# EAGLE design IR_linebot (EAGLE 5.06)
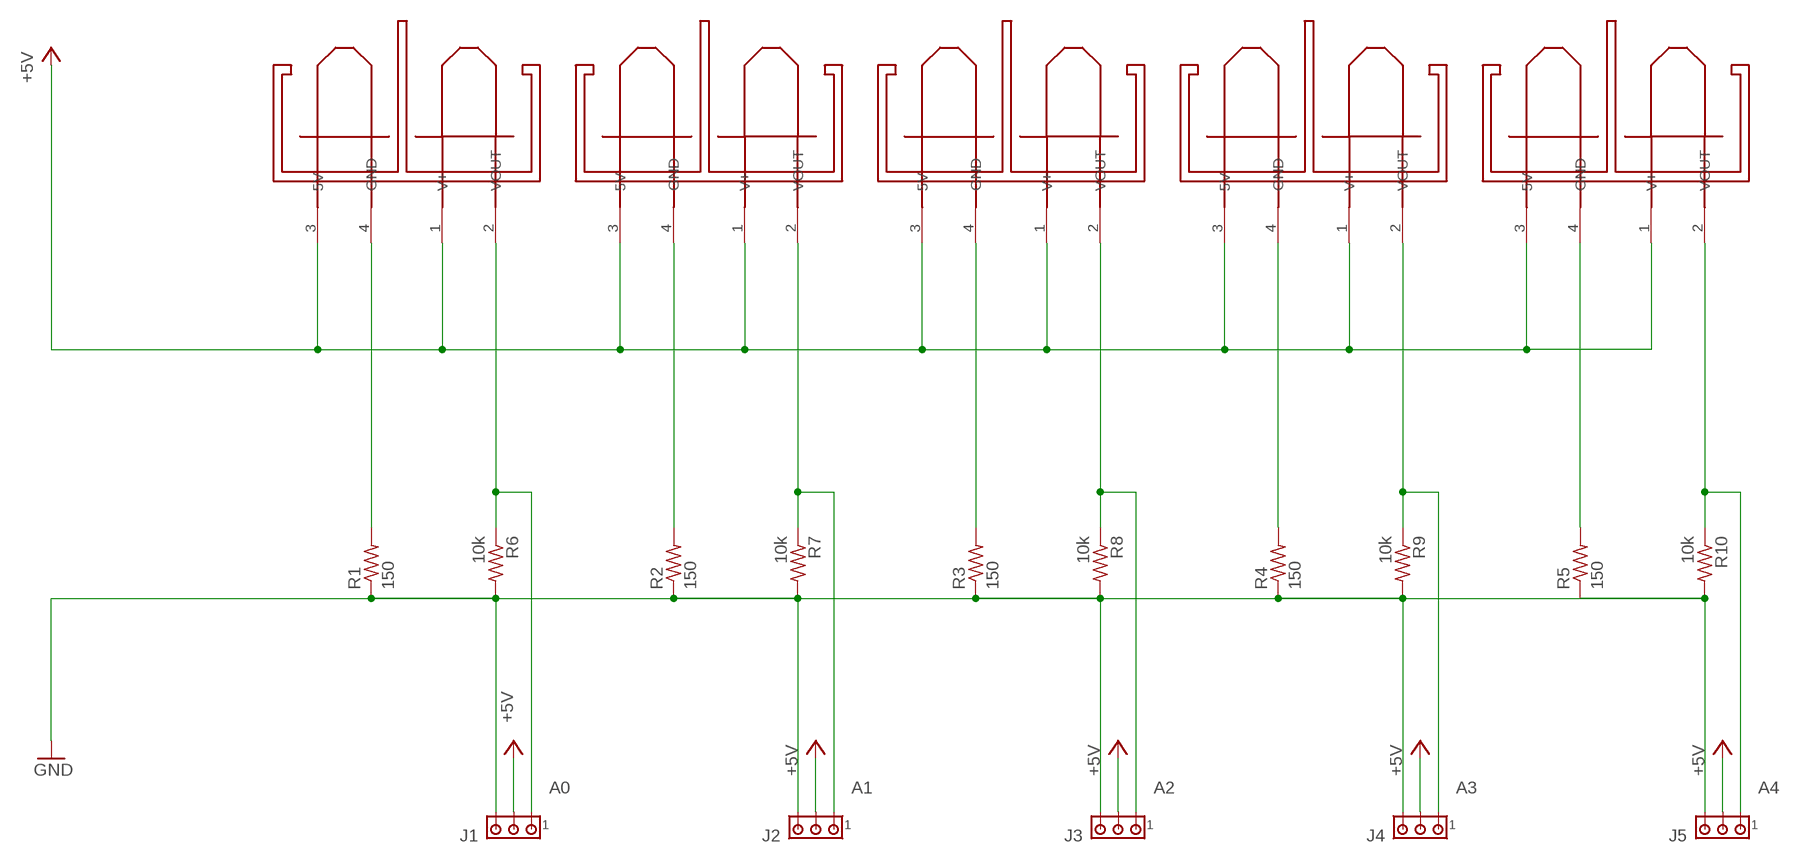
[diagram p0: schematic, sheet 1]

## Parts
IR1  IR_PAIR1  [IR_1]
IR2  IR_PAIR1  [IR_1]
IR3  IR_PAIR1  [IR_1]
IR4  IR_PAIR1  [IR_1]
IR5  IR_PAIR1  [IR_1]
J1  MTA03-100  [10X03MTA]
J2  MTA03-100  [10X03MTA]
J3  MTA03-100  [10X03MTA]
J4  MTA03-100  [10X03MTA]
J5  MTA03-100  [10X03MTA]
R1  150  R-US_0204/7  [0204/7]
R2  150  R-US_0204/7  [0204/7]
R3  150  R-US_0204/7  [0204/7]
R4  150  R-US_0204/7  [0204/7]
R5  150  R-US_0204/7  [0204/7]
R6  10k  R-US_0204/7  [0204/7]
R7  10k  R-US_0204/7  [0204/7]
R8  10k  R-US_0204/7  [0204/7]
R9  10k  R-US_0204/7  [0204/7]
R10  10k  R-US_0204/7  [0204/7]

## Nets
+5V: IR1.1(V+) IR1.3(5V) IR2.1(V+) IR2.3(5V) IR3.1(V+) IR3.3(5V) IR4.1(V+) IR4.3(5V) IR5.1(V+) IR5.3(5V) J1.2 J2.2 J3.2 J4.2 J5.2
A0: IR1.2(VOUT) J1.1 R6.1
A1: IR2.2(VOUT) J2.1 R7.1
A2: IR3.2(VOUT) J3.1 R8.1
A3: IR4.2(VOUT) J4.1 R9.1
A4: IR5.2(VOUT) J5.1 R10.1
GND: J1.3 J2.3 J3.3 J4.3 J5.3 R1.1 R2.1 R3.1 R4.1 R5.1 R6.2 R7.2 R8.2 R9.2 R10.2
N$1: IR1.4(GND) R1.2
N$2: IR2.4(GND) R2.2
N$3: IR3.4(GND) R3.2
N$4: IR4.4(GND) R4.2
N$5: IR5.4(GND) R5.2

## Library data of the parts
IR1-IR5 = A-JD3:IR_PAIR1
J1-J5 = con-amp:MTA03-100: AMP connector
R1-R10 = resistor:R-US_: RESISTOR, American symbol

## Board
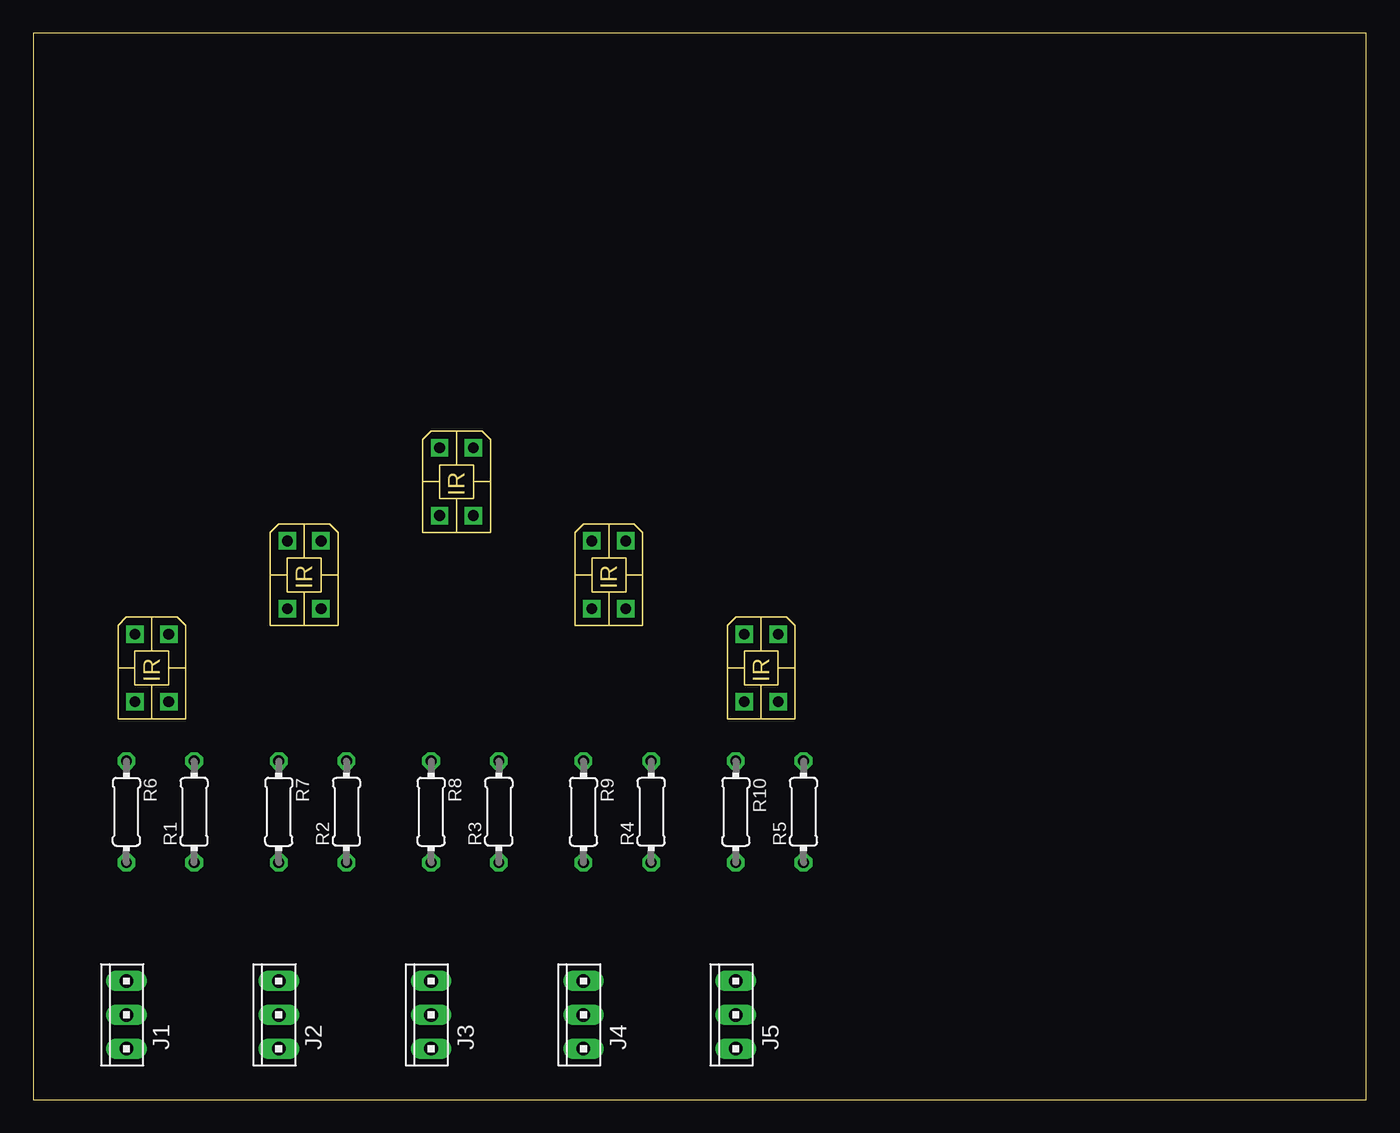
[diagram p1: board, top side]
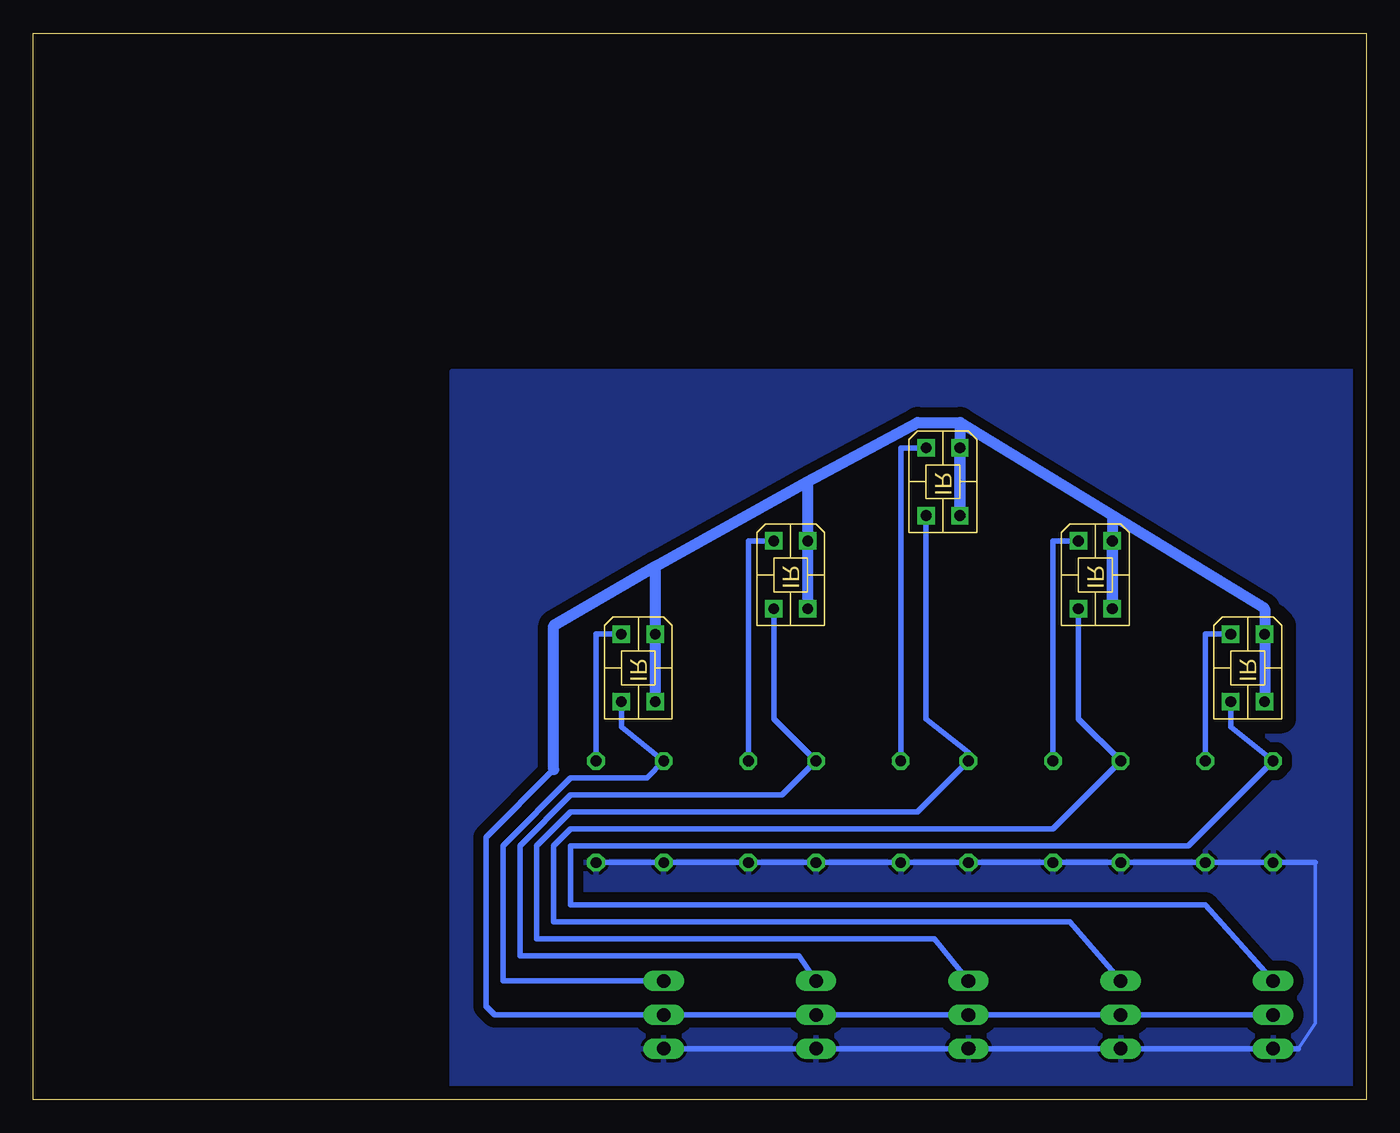
[diagram p2: board, bottom side, seen from below]

Size 100 x 80 mm. Coordinates in mm from the lower left corner, seen from the top.
Outline: 0,0 100,0 100,80 0,80 0,0
Copper layers (1*16): Top 0.035mm / dielectric 1.5mm / Bottom 0.035mm
Design rules "default *": minimum track width 10mil, minimum drill 24mil, track to track 30mil, track to pad 30mil, pad to pad 8mil, via to via 8mil, smd to smd 8mil, copper to edge 40mil, drill to drill 8mil, minimum pad ring 10mil, minimum via ring 8mil, stop-mask expansion 4mil, vias tented up to drill 0mil, thermal gap 10mil

### Footprints (pad centres in the part's own frame; a part is rotated, then mirrored left to right if it is on the bottom)
IR_1 = drill 0.8 square: 1 -2.54,1.27; 2 -2.54,-1.27; 3 2.54,1.27; 4 2.54,-1.27
10X03MTA = drill 1.016 long: 1 2.54,0; 2 0,0; 3 -2.54,0
0204/7 = drill 0.813 octagon: 1 -3.81,0; 2 3.81,0

### Placement (x,y rotation side)
IR1  8.89,32.38 90 top
IR2  20.32,39.37 90 top
IR3  31.75,46.35 90 top
IR4  43.18,39.37 90 top
IR5  54.61,32.38 90 top
J1  6.99,6.35 90 top
J2  18.41,6.35 90 top
J3  29.84,6.35 90 top
J4  41.27,6.35 90 top
J5  52.7,6.35 90 top
R1  12.06,21.59 90 top
R2  23.5,21.59 90 top
R3  34.92,21.59 90 top
R4  46.35,21.59 90 top
R5  57.78,21.59 90 top
R6  6.99,21.59 270 top
R7  18.41,21.59 270 top
R8  29.84,21.59 270 top
R9  41.27,21.59 270 top
R10  52.7,21.59 270 top

### Tracks (layer width: path | path; a pad name or v marks a point on that pad's centre or on a via)
+5V
  Bottom 0.406: J1.2 J2.2 J3.2 J4.2 J5.2 65.41,6.35 66.04,6.99 66.04,19.68 60.96,24.77
  Bottom 0.813: IR1.1 IR1.3 7.62,36.83 19.05,43.81 | 19.05,43.81 IR2.1 IR2.3 19.05,43.81 | 30.48,50.8 IR3.1 IR3.3 30.48,50.8 | 30.48,50.8 19.05,43.81 | IR4.3 IR4.1 IR4.3 | 41.91,46.35 33.66,50.8 30.48,50.8 | IR5.3 IR5.1 IR5.3 | 53.34,40.01 41.91,46.35 | 41.91,46.35 IR4.3 | 53.34,40.01 IR5.3 | 53.34,40.01 60.96,35.56 60.96,24.77
A0
  Bottom 0.406: J1.1 12.06,14.61 59.69,14.61 59.69,19.05 13.34,19.05 R6.1 10.16,27.94 IR1.2
A1
  Bottom 0.406: J2.1 22.23,13.34 60.96,13.34 60.96,19.05 59.69,20.32 23.5,20.32 R7.1 21.59,28.57 IR2.2
A2
  Bottom 0.406: J3.1 32.38,12.06 62.23,12.06 62.23,19.05 59.69,21.59 33.66,21.59 R8.1 29.84,26.04 33.02,28.57 IR3.2
A3
  Bottom 0.406: J4.1 42.55,10.79 63.5,10.79 63.5,19.05 59.69,22.86 43.81,22.86 R9.1 44.45,28.57 IR4.2
A4
  Bottom 0.406: J5.1 64.77,8.89 64.77,19.05 59.69,24.13 53.98,24.13 R10.1 55.88,27.94 IR5.2
GND
  Bottom 0.254: 5.08,3.81 3.81,5.71 3.81,17.78
  Bottom 0.406: J5.3 J4.3 J3.3 J2.3 J1.3 5.08,3.81 | R5.1 R10.2 R4.1 R9.2 R3.1 R8.2 R2.1 R7.2 R1.1 R6.2 3.81,17.78
  pour Bottom: 0.64,54.61 68.58,54.61 68.58,0.64 0.64,0.64
N$1
  Bottom 0.406: R1.2 12.06,34.92 IR1.4
N$2
  Bottom 0.406: R2.2 23.5,41.91 IR2.4
N$3
  Bottom 0.406: R3.2 34.92,48.9 IR3.4
N$4
  Bottom 0.406: R4.2 46.35,41.91 IR4.4
N$5
  Bottom 0.406: R5.2 57.78,34.92 IR5.4